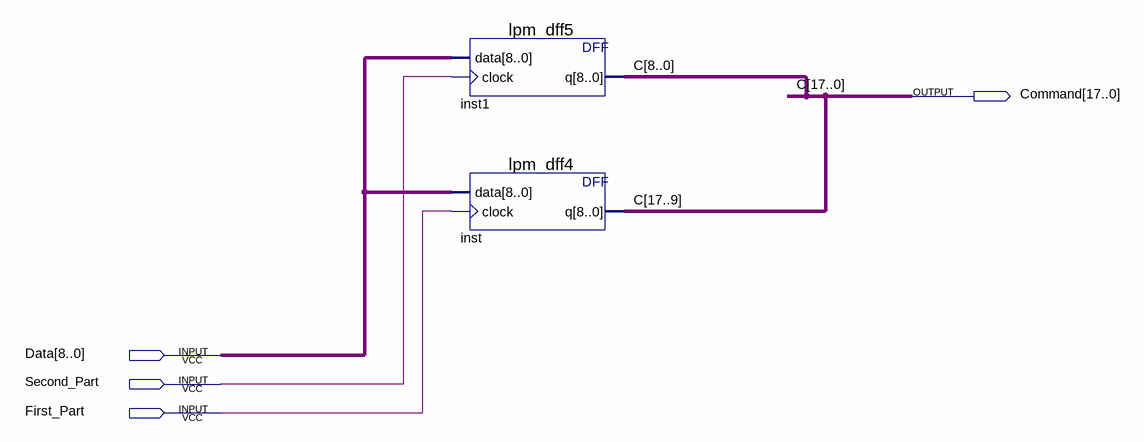
[diagram p0: schematic sheet]
// Quartus schematic Get_Command.bdf as structural Verilog: 2 symbols, 4 pins
module Get_Command (
  input  [8:0] Data,
  input  Second_Part,
  input  First_Part,
  output [17:0] Command
);

  lpm_dff5 inst1 (.data(Data), .clock(Second_Part), .q(Command[8:0]));
  lpm_dff4 inst (.data(Data), .clock(First_Part), .q(Command[17:9]));

  // Other names for the same wires on the sheet: C[17:0] = Command
endmodule
